# EAGLE schematic roomba_main_pcb_v1 (EAGLE 9.5.2)
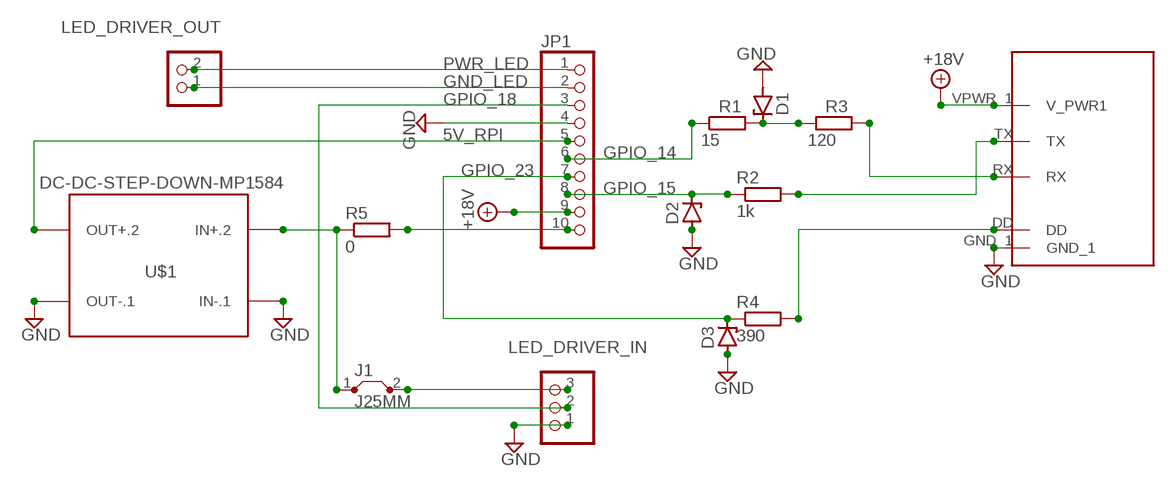
[diagram p0: schematic, sheet 1]

## Parts
D1  ZENER-DIODESOD80C  [SOD80C]
D2  ZENER-DIODESOD80C  [SOD80C]
D3  ZENER-DIODESOD80C  [SOD80C]
J1  J25MM  [25]
JP1  PINHD-1X10/90  [1X10/90]
LED_DRIVER_IN  PINHD-1X3  [1X03]
LED_DRIVER_OUT  PINHD-1X2  [1X02]
R1  15  R-EU_M1206  [M1206]
R2  1k  R-EU_M1206  [M1206]
R3  120  R-EU_M1206  [M1206]
R4  390  R-EU_M1206  [M1206]
R5  0  R-EU_M1206  [M1206]
ROOMBA_PORT  7_PIN  [PIN-7]
U$1  DC-DC-STEP-DOWN-MP1584  [DC-DC-STEP-DOWN-MP1584]

## Nets
5V_RPI: JP1.5 U$1.OUT+.2
+18V: JP1.9 ROOMBA_PORT.VPWR_1(V_PWR1)
GND: D1.A D2.A D3.A JP1.4 LED_DRIVER_IN.1 ROOMBA_PORT.GND_1 U$1.IN-.1 U$1.OUT-.1
GND_LED: JP1.2 LED_DRIVER_OUT.1
GPIO_14: JP1.6 R1.1
GPIO_15: D2.C JP1.8 R2.1
GPIO_18: JP1.3 LED_DRIVER_IN.2
GPIO_23: D3.C JP1.7 R4.1
N$4: J1.1 R5.1 U$1.IN+.2
N$5: R4.2 ROOMBA_PORT.DD
N$6: J1.2 LED_DRIVER_IN.3
N$7: R3.2 ROOMBA_PORT.RX
N$8: D1.C R1.2 R3.1
N$9: R2.2 ROOMBA_PORT.TX
N$11: JP1.10 R5.2
PWR_LED: JP1.1 LED_DRIVER_OUT.2

## Library data of the parts
D1-D3 = diode:ZENER-DIODE: Z-Diode
J1 = jumper:J: Bridge
JP1 = pinhead:PINHD-1X10: PIN HEADER
LED_DRIVER_IN = pinhead:PINHD-1X3: PIN HEADER
LED_DRIVER_OUT = pinhead:PINHD-1X2: PIN HEADER
R1-R5 = rcl:R-EU_: RESISTOR, European symbol; SPICEPREFIX: R
ROOMBA_PORT = M_wifi:7_PIN
U$1 = diy-modules:DC-DC-STEP-DOWN-MP1584: DC/DC Step-Down Regulator based on MP1584 chip MP1584 datasheet available here: http://www.haoyuelectronics.com/Attachment/MP1584/MP1584.pdf Click here to find device on ebay.com <http://www.ebay.com/sch/mp1584+module>